# Altium project science_board_proj_rev_1.PrjPcb
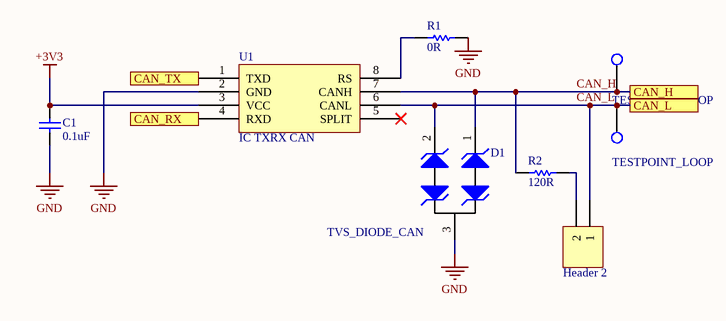
[diagram p0: can.SchDoc]
6 sheets, 127 parts. Net scope: flat (ports and power ports of the same name join across sheets).
Board file: science_board_pcb.PcbDoc
Sheets:
  can.SchDoc
  connectors.SchDoc
  mcu.SchDoc
  ph.SchDoc
  power.SchDoc
  support.SchDoc

## Sheet can.SchDoc: Science Board CAN
size A4

### Parts
1  Header 2  [HDR1X2]
C1  value 0.1uF  [CAPC0603(1608)55_N]  (hidden comment: CAP_0.1uF_16V_0603)
CANH1  TESTPOINT_LOOP  [TESTPOINT_LOOP]
CANL1  TESTPOINT_LOOP  [TESTPOINT_LOOP]
D1  TVS_DIODE_CAN  [TVS_DIODE_CAN]
R1  value 0R  [RESC0603(1608)_N]  (hidden comment: RES_0R_0603)
R2  value 120R  [RESC0603(1608)_N]  (hidden comment: RES_120R_0603)
U1  IC TXRX CAN  [LTC2875]

### Ports
CAN_H, CAN_L, CAN_RX, CAN_TX

### Nets
+3V3: C1.2 U1.3(VCC)
GND: C1.1 D1.3 R1.2 U1.2(GND)
CAN_H: CANH1.1(=value) D1.1 R2.1 U1.7(CANH) ; port CAN_H
CAN_L: 1.1 CANL1.1(=value) D1.2 U1.6(CANL) ; port CAN_L
Net1_2: 1.2 R2.2
NetR1_1: R1.1 U1.8(RS)
NetU1_1: U1.1(TXD) ; port CAN_TX
NetU1_4: U1.4(RXD) ; port CAN_RX

Not connected (* = marked no-connect by the designer): U1 5(SPLIT)*

### Library data of the parts
1 = Header 2: Header, 2-Pin; LatestRevisionDate: 17-Jul-2002; LatestRevisionNote: Re-released for DXP Platform.; Publisher: Altium Limited
C1 = CAP_0.1uF_16V_0603: CAP CER 0.1UF 16V X7R 0603; Part Number: CC0603KRX7R7BB104; Manufacturer: Yageo; Dimensions: 0.063" L x 0.031" W (1.60mm x 0.80mm); Package: 0603 (1608 Metric); Temperature Coefficient: X7R; Voltage Rating: 16V
D1 = TVS_DIODE_CAN: TVS DIODE 24V 41V SOT323-3; Part Number: PESD2CAN,215; Manufacturer: Nexperia USA Inc.; Package: SC-70, SOT-323; ComponentLink1Description: Datasheet; ComponentLink1URL: https://assets.nexperia.com/documents/data-sheet/PESD1CAN-U.pdf
R1 = RES_0R_0603: RES SMD 0 OHM JUMPER 1/10W 0603; Manufacturer: Yageo; Part Number (MPN): RC0603JR-070RL; Package: 0603 (1608 Metric); Dimensions: 0.063" L x 0.031" W (1.60mm x 0.80mm)
R2 = RES_120R_0603: RES SMD 120 OHM 5% 1/10W 0603; Manufacturer: Yageo; Part Number (MPN): RC0603JR-07120RL; Package: 0603 (1608 Metric); Dimensions: 0.063" L x 0.031" W (1.60mm x 0.80mm); Tolerance: 5%
U1 = LTC2875: IC TXRX CAN 4MBPS 8SO; Manufacturer: Linear Technologies; Part Number: LTC2875IS8#PBF; Package: 8-SOIC (0.154", 3.90mm Width); ComponentLink1Description: Datasheet; ComponentLink1URL: https://www.analog.com/media/en/technical-documentation/data-sheets/2875f.pdf

## Sheet connectors.SchDoc: Science Board Connectors
size A4; DrawnBy: Adrianna Ascalon
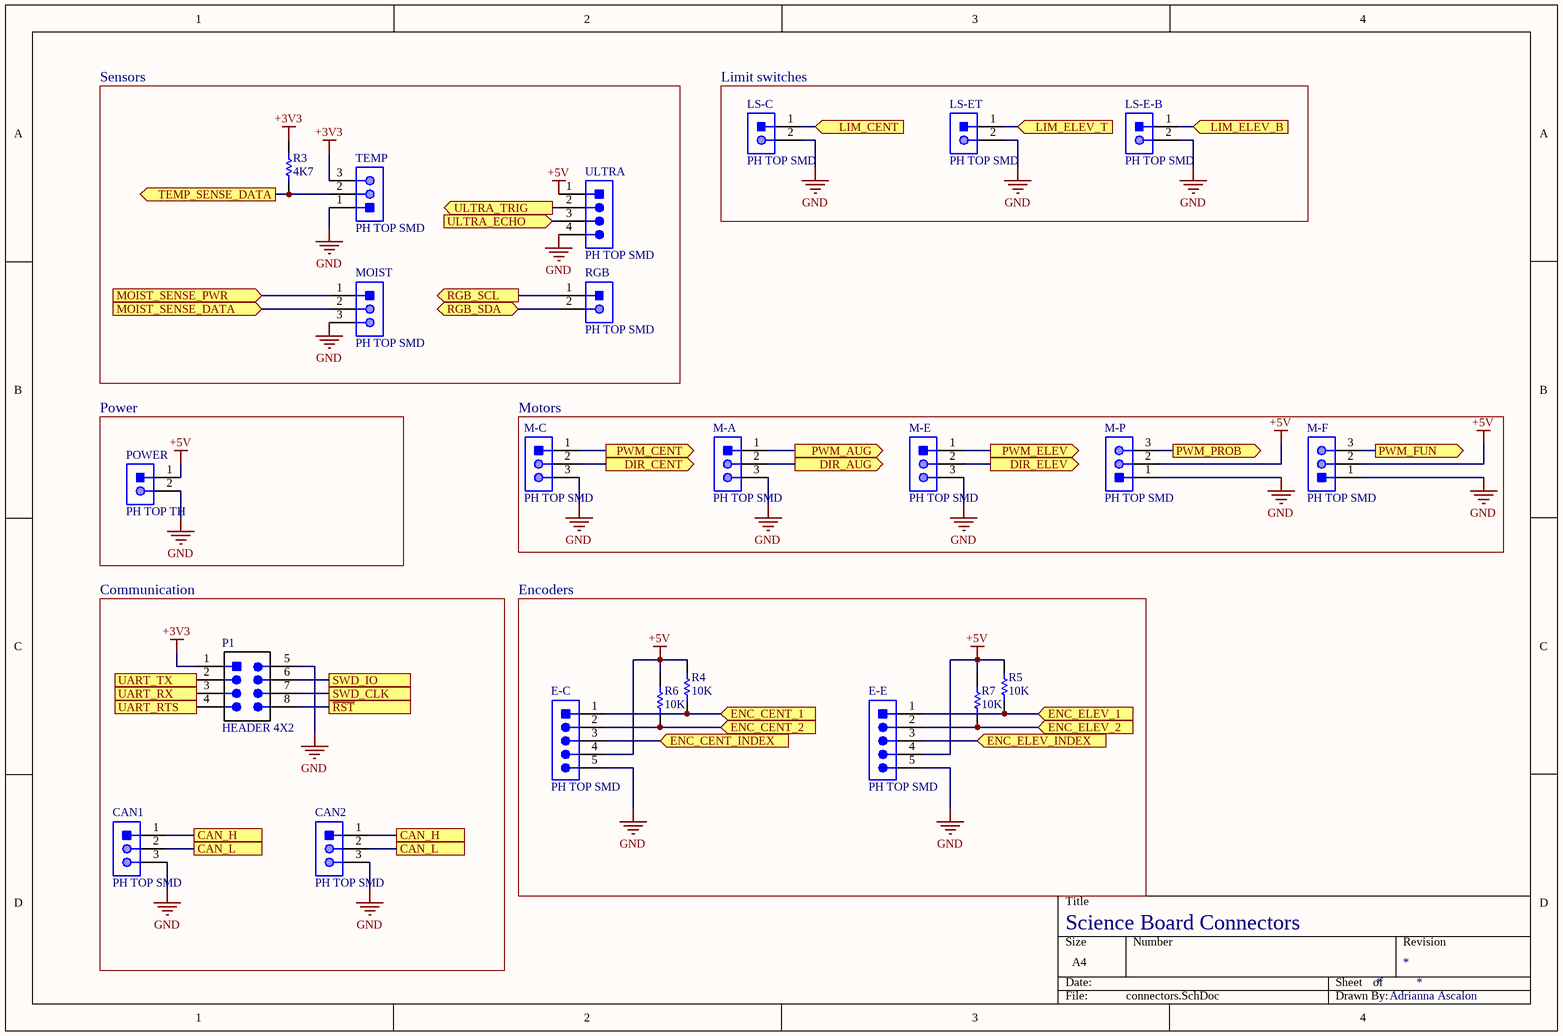
[diagram p1: connectors.SchDoc]

### Parts
CAN1  PH TOP SMD  [JST-B3B-SM4-TB]
CAN2  PH TOP SMD  [JST-B3B-SM4-TB]
E-C  PH TOP SMD  [JST-B5B-SM4-TB]
E-E  PH TOP SMD  [JST-B5B-SM4-TB]
LS-C  PH TOP SMD  [JST-B2B-SM4-TB]
LS-E-B  PH TOP SMD  [JST-B2B-SM4-TB]
LS-ET  PH TOP SMD  [JST-B2B-SM4-TB]
M-A  PH TOP SMD  [JST-B3B-SM4-TB]
M-C  PH TOP SMD  [JST-B3B-SM4-TB]
M-E  PH TOP SMD  [JST-B3B-SM4-TB]
M-F  PH TOP SMD  [JST-B3B-SM4-TB]
M-P  PH TOP SMD  [JST-B3B-SM4-TB]
MOIST  PH TOP SMD  [JST-B3B-SM4-TB]
P1  HEADER 4X2  [HEADER_2X4]
POWER  PH TOP TH  [JST-B2B-PHSK]
R3  value 4K7  [RESC0603(1608)_N]  (hidden comment: RES_4K7_0603)
R4  value 10K  [RESC0603(1608)_N]  (hidden comment: RES_10K_0603)
R5  value 10K  [RESC0603(1608)_N]  (hidden comment: RES_10K_0603)
R6  value 10K  [RESC0603(1608)_N]  (hidden comment: RES_10K_0603)
R7  value 10K  [RESC0603(1608)_N]  (hidden comment: RES_10K_0603)
RGB  PH TOP SMD  [JST-B2B-SM4-TB]
TEMP  PH TOP SMD  [JST-B3B-SM4-TB]
ULTRA  PH TOP SMD  [JST-B4B-SM4-TB]

### Blocks framed on the sheet
Sensors: MOIST R3 RGB TEMP ULTRA
Limit switches: LS-C LS-E-B LS-ET
Power: POWER
Motors: M-A M-C M-E M-F M-P
Communication: CAN1 CAN2 P1
Encoders: E-C E-E R4-R7

### Ports
CAN_H, CAN_L, DIR_AUG (out), DIR_CENT (out), DIR_ELEV (out), ENC_CENT_1 (in), ENC_CENT_2 (in), ENC_CENT_INDEX (in), ENC_ELEV_1 (in), ENC_ELEV_2 (in), ENC_ELEV_INDEX (in), LIM_CENT (in), LIM_ELEV_B (in), LIM_ELEV_T (in), MOIST_SENSE_DATA (in), MOIST_SENSE_PWR (in), PWM_AUG (out), PWM_CENT (out), PWM_ELEV (out), PWM_FUN (out), PWM_PROB (out), RGB_SCL (out), RGB_SDA (bidir), SWD_CLK, SWD_IO, TEMP_SENSE_DATA (out), UART_RTS, UART_RX (in), UART_TX (out), ULTRA_ECHO (in), ULTRA_TRIG (out), ~{RST}

### Nets
+3V3: P1.1(VCC) R3.2 TEMP.3
+5V: E-C.4 E-E.4 M-F.2 M-P.2 POWER.1 R4.2 R5.2 R6.2 R7.2 ULTRA.1
GND: CAN1.3 CAN2.3 E-C.5 E-E.5 LS-C.2 LS-E-B.2 LS-ET.2 M-A.3 M-C.3 M-E.3 M-F.1 M-P.1 MOIST.3 P1.5(GND) POWER.2 TEMP.1 ULTRA.4
CAN_H: CAN1.1 CAN2.1 ; port CAN_H
CAN_L: CAN1.2 CAN2.2 ; port CAN_L
~{RST}: P1.8 ; port ~{RST}
NetE-C_1: E-C.1 R4.1 ; port ENC_CENT_1
NetE-C_2: E-C.2 R6.1 ; port ENC_CENT_2
NetE-C_3: E-C.3 ; port ENC_CENT_INDEX
NetE-E_1: E-E.1 R5.1 ; port ENC_ELEV_1
NetE-E_2: E-E.2 R7.1 ; port ENC_ELEV_2
NetE-E_3: E-E.3 ; port ENC_ELEV_INDEX
NetLS-C_1: LS-C.1 ; port LIM_CENT
NetLS-E-B_1: LS-E-B.1 ; port LIM_ELEV_B
NetLS-ET_1: LS-ET.1 ; port LIM_ELEV_T
NetM-A_1: M-A.1 ; port PWM_AUG
NetM-A_2: M-A.2 ; port DIR_AUG
NetM-C_1: M-C.1 ; port PWM_CENT
NetM-C_2: M-C.2 ; port DIR_CENT
NetM-E_1: M-E.1 ; port PWM_ELEV
NetM-E_2: M-E.2 ; port DIR_ELEV
NetM-F_3: M-F.3 ; port PWM_FUN
NetM-P_3: M-P.3 ; port PWM_PROB
NetMOIST_1: MOIST.1 ; port MOIST_SENSE_PWR
NetMOIST_2: MOIST.2 ; port MOIST_SENSE_DATA
NetP1_2: P1.2 ; port UART_TX
NetP1_3: P1.3 ; port UART_RX
NetP1_4: P1.4 ; port UART_RTS
NetP1_6: P1.6 ; port SWD_IO
NetP1_7: P1.7 ; port SWD_CLK
NetR3_1: R3.1 TEMP.2 ; port TEMP_SENSE_DATA
NetR17_1: RGB.1 ; port RGB_SCL
NetR18_1: RGB.2 ; port RGB_SDA
NetU2_29: ULTRA.2 ; port ULTRA_TRIG
NetU2_30: ULTRA.3 ; port ULTRA_ECHO

### Library data of the parts
CAN1 CAN2 M-A M-C M-E M-F M-P MOIST TEMP = CON_3M_PH_TOP_SMT: CONN HEADER PH TOP 3POS 2MM SMD; Manufacturer: JST; Part Number: B3B-PH-SM4-TB; ComponentLink1Description: Datasheet; ComponentLink1URL: http://www.jst-mfg.com/product/pdf/eng/ePH.pdf
E-C E-E = CON_5M_PH_TOP_SMT: CONN HEADER PH TOP 5POS 2MM SMD; Manufacturer: JST; Part Number: B5B-PH-SM4-TB; ComponentLink1Description: Datasheet; ComponentLink1URL: http://www.jst-mfg.com/product/pdf/eng/ePH.pdf
LS-C LS-E-B LS-ET RGB = CON_2M_PH_TOP_SMT: CONN HEADER PH TOP 2POS 2MM SMD; Manufacturer: JST; Part Number: B2B-PH-SM4-TB; ComponentLink1Description: Datasheet; ComponentLink1URL: http://www.jst-mfg.com/product/pdf/eng/ePH.pdf
P1 = HEADER 4X2: Header, 4-Pin Dual row; LatestRevisionDate: 17-Jul-2002; LatestRevisionNote: Re-released for DXP Platform.; Publisher: Altium Limited
POWER = CON_2M_PH_TOP_TH: CONN HEADER PH TOP 2POS 2MM; Manufacturer: JST; Part Number: B2B-PH-K-S; ComponentLink1Description: Datasheet; ComponentLink1URL: http://www.jst-mfg.com/product/pdf/eng/ePH.pdf
R3 = RES_4K7_0603: RES SMD 4.7K OHM 5% 1/10W 0603; Manufacturer: Yageo; Part Number (MPN): RC0603JR-074K7L; Package: 0603 (1608 Metric); Dimensions: 0.063" L x 0.031" W (1.60mm x 0.80mm); Tolerance: 5%
R4-R7 = RES_10K_0603: RES SMD 10K OHM 5% 1/10W 0603; Manufacturer: Yageo; Part Number (MPN): RC0603JR-0710KL; Package: 0603 (1608 Metric); Dimensions: 0.063" L x 0.031" W (1.60mm x 0.80mm); Tolerance: 5%
ULTRA = CON_4M_PH_TOP_SMT: CONN HEADER PH TOP 4POS 2MM SMD; Manufacturer: JST; Part Number: B4B-PH-SM4-TB; ComponentLink1Description: Datasheet; ComponentLink1URL: http://www.jst-mfg.com/product/pdf/eng/ePH.pdf

## Sheet mcu.SchDoc: Science Board MCU
size A4; DrawnBy: Adrianna Ascalon
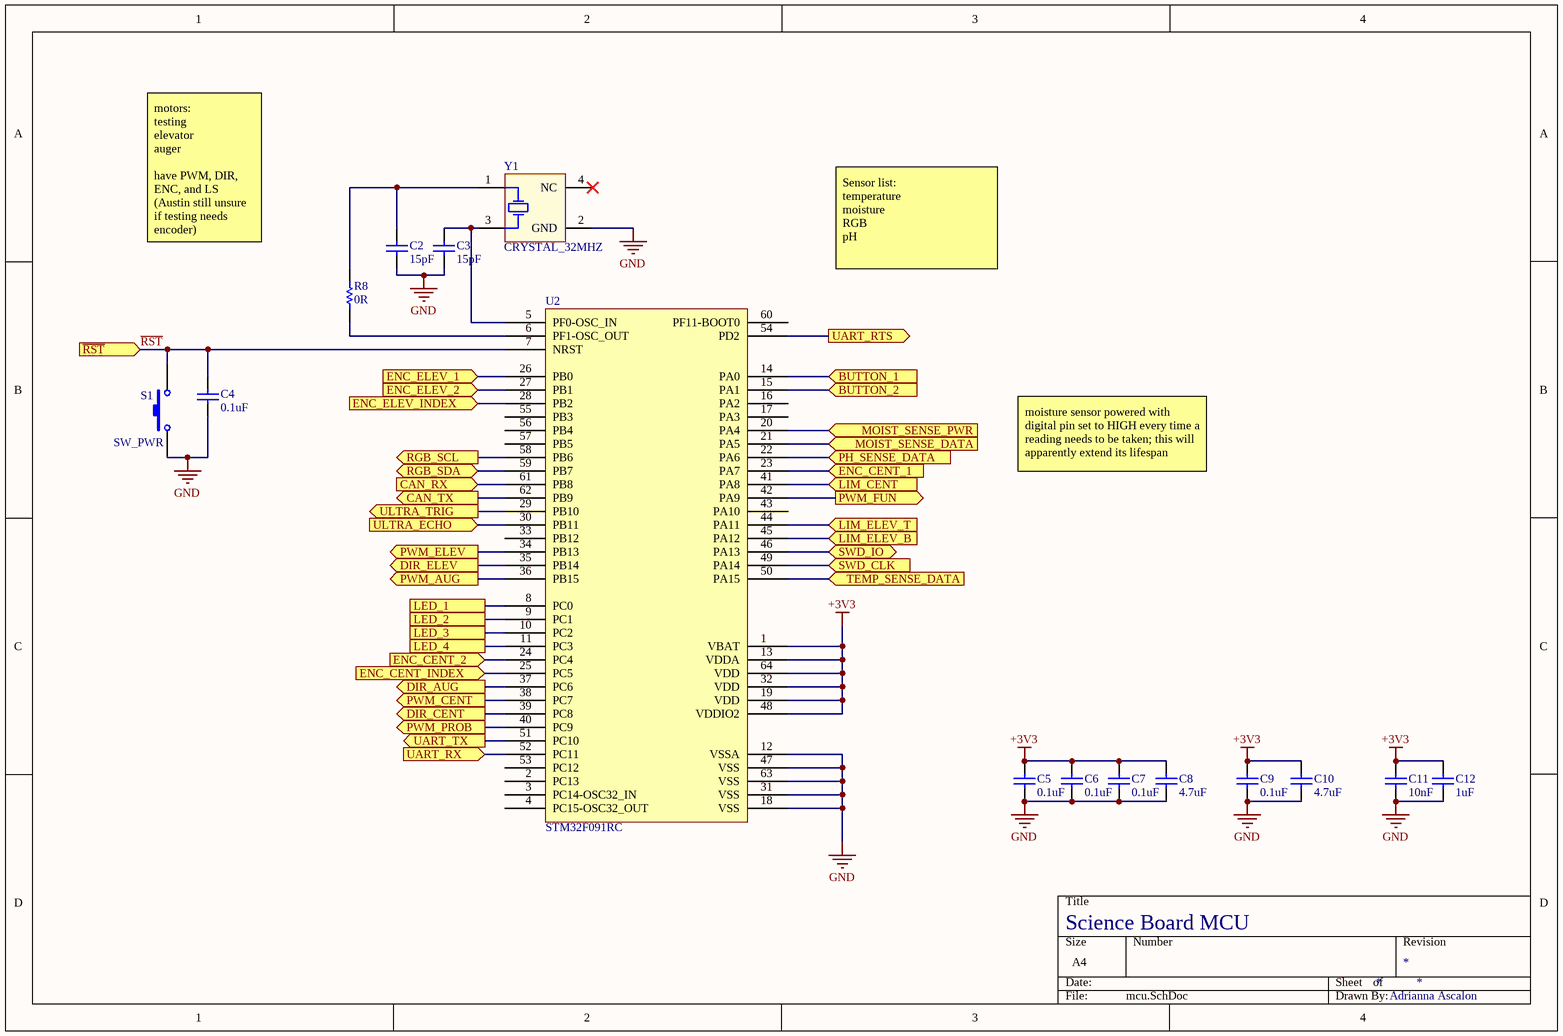
[diagram p2: mcu.SchDoc]

### Parts
C2  value 15pF  [CAPC0603(1608)55_N]  (hidden comment: CAP_15pF_0603)
C3  value 15pF  [CAPC0603(1608)55_N]  (hidden comment: CAP_15pF_0603)
C4  value 0.1uF  [CAPC0603(1608)55_N]  (hidden comment: CAP_0.1uF_16V_0603)
C5  value 0.1uF  [CAPC0603(1608)55_N]  (hidden comment: CAP_0.1uF_16V_0603)
C6  value 0.1uF  [CAPC0603(1608)55_N]  (hidden comment: CAP_0.1uF_16V_0603)
C7  value 0.1uF  [CAPC0603(1608)55_N]  (hidden comment: CAP_0.1uF_16V_0603)
C8  value 4.7uF  [CAPC0603(1608)55_N]  (hidden comment: CAP_4.7uF_0603)
C9  value 0.1uF  [CAPC0603(1608)55_N]  (hidden comment: CAP_0.1uF_16V_0603)
C10  value 4.7uF  [CAPC0603(1608)55_N]  (hidden comment: CAP_4.7uF_0603)
C11  value 10nF  [CAPC0603(1608)55_N]  (hidden comment: CAP_10nF_0603)
C12  value 1uF  [CAPC0603(1608)55_N]  (hidden comment: CAP_1uF_16V_0603)
R8  value 0R  [RESC0603(1608)_N]  (hidden comment: RES_0R_0603)
S1  SW_PWR  [PTS830GM140]
U2  STM32F091RC  [STM_LQFP64_N]
Y1  CRYSTAL_32MHZ  [AVX-CX2520DB32000D0GEJZ1-4_V]

### Ports
BUTTON_1 (in), BUTTON_2 (in), CAN_RX (in), CAN_TX (out), DIR_AUG (out), DIR_CENT (out), DIR_ELEV (out), ENC_CENT_1 (in), ENC_CENT_2 (in), ENC_CENT_INDEX (in), ENC_ELEV_1 (in), ENC_ELEV_2 (in), ENC_ELEV_INDEX (in), LED_1, LED_2, LED_3, LED_4, LIM_CENT (in), LIM_ELEV_B (in), LIM_ELEV_T (in), MOIST_SENSE_DATA (in), MOIST_SENSE_PWR (in), PH_SENSE_DATA (in), PWM_AUG (out), PWM_CENT (out), PWM_ELEV (out), PWM_FUN (out), PWM_PROB (out), RGB_SCL (out), RGB_SDA (bidir), SWD_CLK (in), SWD_IO (bidir), TEMP_SENSE_DATA (in), UART_RTS (out), UART_RX (in), UART_TX (out), ULTRA_ECHO (in), ULTRA_TRIG (out), ~{RST} (in)

### Nets
+3V3: C5.1 C6.1 C7.1 C8.2 C9.1 C10.2 C11.2 C12.2 U2.1(VBAT) U2.13(VDDA) U2.19(VDD) U2.32(VDD) U2.48(VDDIO2) U2.64(VDD)
GND: C2.1 C3.1 C4.1 C5.2 C6.2 C7.2 C8.1 C9.2 C10.1 C11.1 C12.1 S1.1 U2.12(VSSA) U2.18(VSS) U2.31(VSS) U2.47(VSS) U2.63(VSS) Y1.2(GND)
~{RST}: C4.2 S1.2 U2.7(NRST) ; port ~{RST}
NetC2_2: C2.2 R8.2 Y1.1(HOT)
NetC3_2: C3.2 U2.5(PF0-OSC_IN) Y1.3(HOT)
NetE-C_1: U2.23(PA7) ; port ENC_CENT_1
NetE-C_2: U2.24(PC4) ; port ENC_CENT_2
NetE-C_3: U2.25(PC5) ; port ENC_CENT_INDEX
NetE-E_1: U2.26(PB0) ; port ENC_ELEV_1
NetE-E_2: U2.27(PB1) ; port ENC_ELEV_2
NetE-E_3: U2.28(PB2) ; port ENC_ELEV_INDEX
NetLS-C_1: U2.41(PA8) ; port LIM_CENT
NetLS-E-B_1: U2.45(PA12) ; port LIM_ELEV_B
NetLS-ET_1: U2.44(PA11) ; port LIM_ELEV_T
NetM-A_1: U2.36(PB15) ; port PWM_AUG
NetM-A_2: U2.37(PC6) ; port DIR_AUG
NetM-C_1: U2.38(PC7) ; port PWM_CENT
NetM-C_2: U2.39(PC8) ; port DIR_CENT
NetM-E_1: U2.34(PB13) ; port PWM_ELEV
NetM-E_2: U2.35(PB14) ; port DIR_ELEV
NetM-F_3: U2.42(PA9) ; port PWM_FUN
NetM-P_3: U2.40(PC9) ; port PWM_PROB
NetMOIST_1: U2.20(PA4) ; port MOIST_SENSE_PWR
NetMOIST_2: U2.21(PA5) ; port MOIST_SENSE_DATA
NetP1_2: U2.51(PC10) ; port UART_TX
NetP1_3: U2.52(PC11) ; port UART_RX
NetP1_4: U2.54(PD2) ; port UART_RTS
NetP1_6: U2.46(PA13) ; port SWD_IO
NetP1_7: U2.49(PA14) ; port SWD_CLK
NetPH_1: U2.22(PA6) ; port PH_SENSE_DATA
NetR3_1: U2.50(PA15) ; port TEMP_SENSE_DATA
NetR8_1: R8.1 U2.6(PF1-OSC_OUT)
NetR17_1: U2.58(PB6) ; port RGB_SCL
NetR18_1: U2.59(PB7) ; port RGB_SDA
NetR27_1: U2.8(PC0) ; port LED_1
NetR28_1: U2.9(PC1) ; port LED_2
NetR29_1: U2.14(PA0) ; port BUTTON_1
NetR30_1: U2.10(PC2) ; port LED_3
NetR31_2: U2.15(PA1) ; port BUTTON_2
NetR33_1: U2.11(PC3) ; port LED_4
NetU1_1: U2.62(PB9) ; port CAN_TX
NetU1_4: U2.61(PB8) ; port CAN_RX
NetU2_29: U2.29(PB10) ; port ULTRA_TRIG
NetU2_30: U2.30(PB11) ; port ULTRA_ECHO

Not connected (* = marked no-connect by the designer): U2 2(PC13) 3(PC14-OSC32_IN) 4(PC15-OSC32_OUT) 16(PA2) 17(PA3) 33(PB12) 43(PA10) 53(PC12) 55(PB3) 56(PB4) 57(PB5) 60(PF11-BOOT0); Y1 4(NC)*

### Notes on the sheet
- motors:
  testing
  elevator
  auger
  have PWM, DIR, ENC, and LS
  (Austin still unsure if testing needs encoder)
  Auger doesn't need ENC or LS
- Sensor list:
  temperature
  moisture
  RGB
  pH
- moisture sensor powered with digital pin set to HIGH every time a reading needs to be taken; this will apparently extend its lifespan

### Library data of the parts
C2 C3 = CAP_15pF_0603: CAP CER 15PF 250V NPO 0603; Part Number: AC0603JRNPOYBN150; Manufacturer: Yageo; Temperature Coefficient: NP0; Dimensions: 0.063" L x 0.031" W (1.60mm x 0.80mm); Package: 0603 (1608 Metric); Voltage Rating: 250v
C4-C7 C9 = CAP_0.1uF_16V_0603: as C1 on sheet can; Dimensions: 0.063" L x 0.031" W (1.60mm x 0.80mm); Package: 0603 (1608 Metric); Temperature Coefficient: X7R; Voltage Rating: 16V
C8 C10 = CAP_4.7uF_0603: CAP CER 4.7UF 6.3V X5R 0603; Part Number: CC0603KRX5R5BB475; Manufacturer: Yageo; Dimensions: 0.063" L x 0.031" W (1.60mm x 0.80mm); Package: 0603 (1608 Metric); Temperature Coefficient: X5R; Voltage Rating: 6.3V
C11 = CAP_10nF_0603: CAP CER 10000PF 16V X7R 0603; Part Number: CC0603KRX7R7BB103; Manufacturer: Yageo; Dimensions: 0.063" L x 0.031" W (1.60mm x 0.80mm); Package: 0603 (1608 Metric); Temperature Coefficient: X7R; Voltage Rating: 16V
C12 = CAP_1uF_16V_0603: CAP CER 1UF 16V Y5V 0603; Part Number: CC0603ZRY5V7BB105; Manufacturer: Yageo; Dimensions: 0.063" L x 0.031" W (1.60mm x 0.80mm); Package: 0603 (1608 Metric); Temperature Coefficient: Y5V; Voltage Rating: 16V
R8 = RES_0R_0603: as R1 on sheet can; Package: 0603 (1608 Metric); Dimensions: 0.063" L x 0.031" W (1.60mm x 0.80mm)
S1 = SW_PWR: Power Switch (Red); pin to pad: 2>4; Part Number: PTS830GM140 SMTR LFS; ComponentLink1Description: Datasheet; ComponentLink1URL: https://www.ckswitches.com/media/1478/pts830.pdf
U2 = STM32F091RC: Manufacturer: STMicroelectronics; Part Number: STM32F091RC; Package: 64-LQFP; ComponentLink1Description: Datasheet; ComponentLink1URL: https://www.st.com/content/ccc/resource/technical/document/datasheet/95/3c/2e/5b/21/09/45/a6/DM00115237.pdf/files/DM00115237.pdf/jcr:content/translations/en.DM00115237.pdf#%5B%7B%22num%22%3A96%2C%22gen%22%3A0%7D%2C%7B%22name%22%3A%22XYZ%22%7D%2C67%2C755%2Cnull%5D
Y1 = CRYSTAL_32MHZ: CRYSTAL 32MHZ 8PF SMD; Part Number: CX2520DB32000D0GPSC1; Manufacturer: Kyocera International Inc. Electronic Components; Package: 4-SMD, No Lead; Dimensions: 0.098" L x 0.079" W (2.50mm x 2.00mm)

## Sheet ph.SchDoc: Science Board pH Sensing
size A4
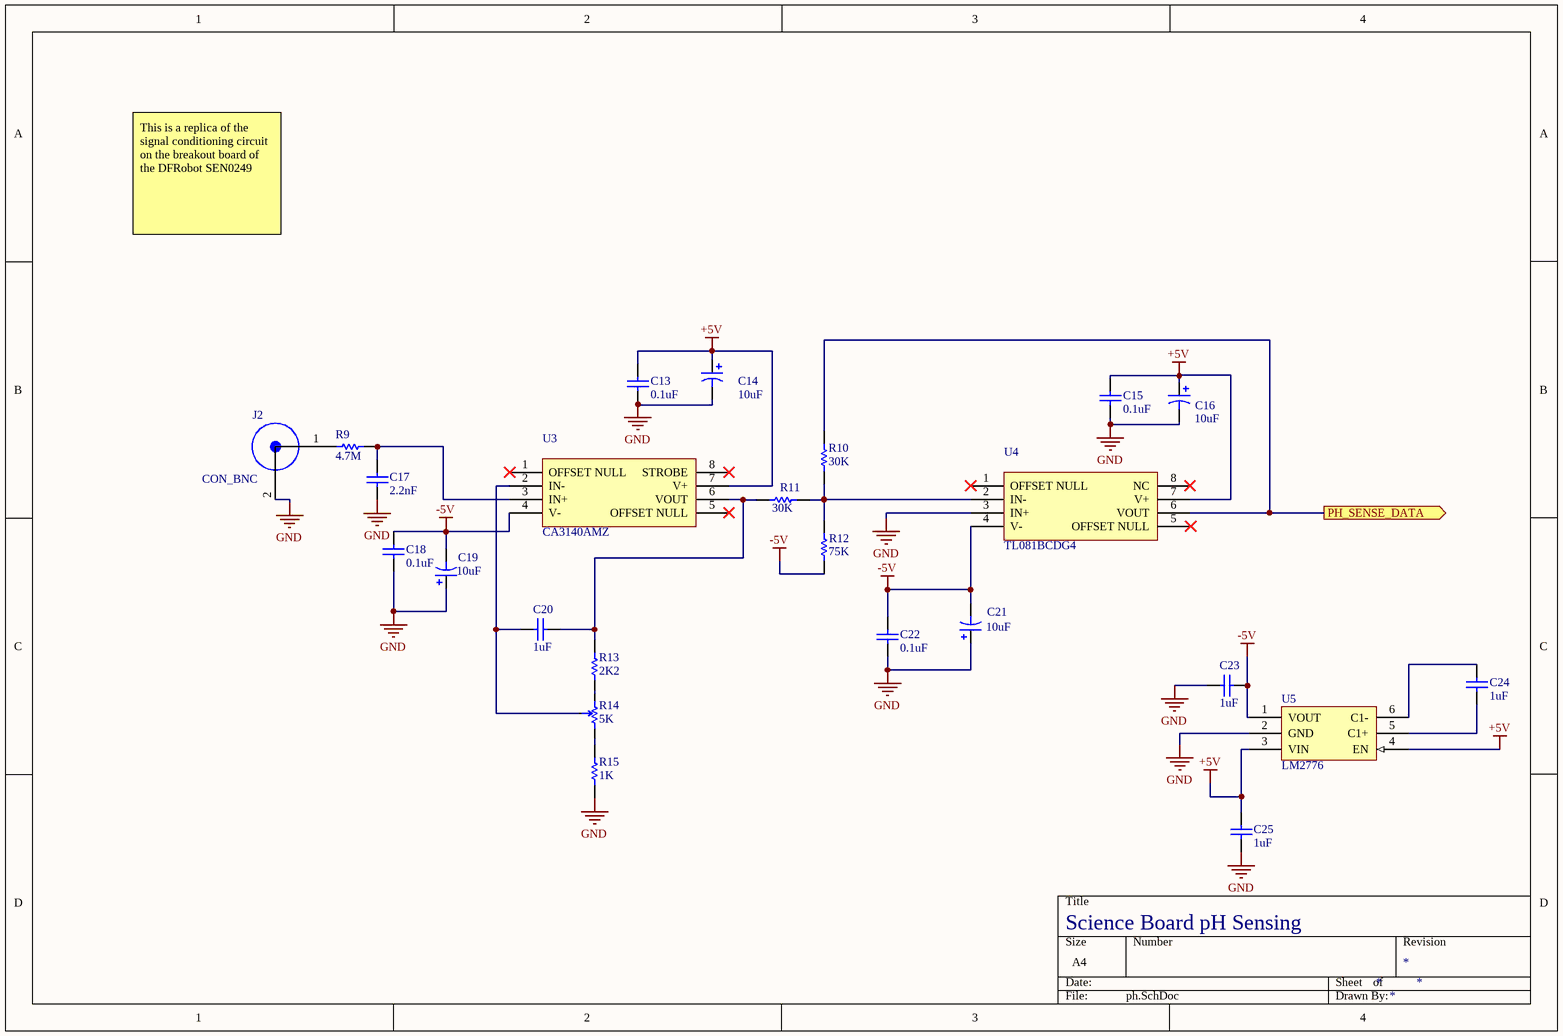
[diagram p3: ph.SchDoc]

### Parts
C13  value 0.1uF  [CAPC0603(1608)55_N]  (hidden comment: CAP_0.1uF_50V_0603)
C14  value 10uF  [AVX-CAPC3528_V]  (hidden comment: CAP_10uF_0603_POL)
C15  value 0.1uF  [CAPC0603(1608)55_N]  (hidden comment: CAP_0.1uF_50V_0603)
C16  value 10uF  [AVX-CAPC3528_V]  (hidden comment: CAP_10uF_0603_POL)
C17  value 2.2nF  [CAPC0603(1608)55_N]  (hidden comment: CAP_2.2nF_0603)
C18  value 0.1uF  [CAPC0603(1608)55_N]  (hidden comment: CAP_0.1uF_50V_0603)
C19  value 10uF  [AVX-CAPC3528_V]  (hidden comment: CAP_10uF_0603_POL)
C20  value 1uF  [CAPC0603(1608)55_N]  (hidden comment: CAP_1uF_16V_0603)
C21  value 10uF  [AVX-CAPC3528_V]  (hidden comment: CAP_10uF_0603_POL)
C22  value 0.1uF  [CAPC0603(1608)55_N]  (hidden comment: CAP_0.1uF_50V_0603)
C23  value 1uF  [CAPC0603(1608)55_N]  (hidden comment: CAP_1uF_16V_0603)
C24  value 1uF  [CAPC0603(1608)55_N]  (hidden comment: CAP_1uF_16V_0603)
C25  value 1uF  [CAPC0603(1608)55_N]  (hidden comment: CAP_1uF_16V_0603)
J2  CON_BNC  [1-1337543-0]
R9  value 4.7M  [RESC0603(1608)_N]  (hidden comment: RES_4M7_0603)
R10  value 30K  [RESC0603(1608)_N]  (hidden comment: RES_30K_0603)
R11  value 30K  [RESC0603(1608)_N]  (hidden comment: RES_30K_0603)
R12  value 75K  [RESC0603(1608)_N]  (hidden comment: RES_75K_0603)
R13  value 2K2  [RESC0603(1608)_N]  (hidden comment: RES_2K2_0603)
R14  value 5K  [3362P-1-502LF]  (hidden comment: POT_5K)
R15  value 1K  [RESC0603(1608)_N]  (hidden comment: RES_1K_0603)
U3  CA3140AMZ  [CA3140AMZ]
U4  TL081BCDG4  [TL081BCDG4]
U5  LM2776  [SOT23-6]

### Ports
PH_SENSE_DATA (out)

### Nets
+5V: C13.2 C14.1 C15.2 C16.1 C25.2 U3.7(V+) U4.7(V+) U5.3(VIN) U5.4(EN)
-5V: C18.2 C19.2 C21.2 C22.2 C23.1 R12.1 U3.4(V-) U4.4(V-) U5.1(VOUT)
GND: C13.1 C14.2 C15.1 C16.2 C17.1 C18.1 C19.1 C21.1 C22.1 C23.2 C25.1 J2.2 R15.1 U4.3(IN+) U5.2(GND)
NetC17_2: C17.2 R9.2 U3.3(IN+)
NetC20_1: C20.1 R14.3 U3.2(IN-)
NetC20_2: C20.2 R11.1 R13.2 U3.6(VOUT)
NetC24_1: C24.1 U5.5(C1+)
NetC24_2: C24.2 U5.6(C1-)
NetJ2_1: J2.1 R9.1
NetPH_1: R10.2 U4.6(VOUT) ; port PH_SENSE_DATA
NetR10_1: R10.1 R11.2 R12.2 U4.2(IN-)
NetR13_1: R13.1 R14.1
NetR14_2: R14.2 R15.2

Not connected (* = marked no-connect by the designer): U3 1(OFFSET_NULL)* 5(OFFSET_NULL)* 8(STROBE)*; U4 1(OFFSET_NULL)* 5(OFFSET_NULL)* 8(NC)*

### Notes on the sheet
- This is a replica of the signal conditioning circuit on the breakout board of the DFRobot SEN0249

### Library data of the parts
C13 C15 C18 C22 = CAP_0.1uF_50V_0603: CAP CER 0.1UF 50V X7R 0603; Part Number: GCM188R71H104KA57D; Manufacturer: Yageo; Dimensions: 0.063" L x 0.031" W (1.60mm x 0.80mm); Package: 0603 (1608 Metric); Temperature Coefficient: X7R; Voltage Rating: 50V
C14 C16 C19 C21 = CAP_10uF_0603_POL: Capacitor, Tantalum, 10uF 10% 20V MCCT-B (3528); Part Number: CC0603MRX5R6BB106; Manufacturer: Yageo; Temperature Coefficient: X5R; Voltage Rating: 10V; Dimensions: 0.063" L x 0.031" W (1.60mm x 0.80mm); Package: 0603 (1608 Metric)
C17 = CAP_2.2nF_0603: CAP CER 2.2NF 25V X7R 0603; Part Number: CC0603KRX7R8BB222; Manufacturer: Yageo; Dimensions: 0.063" L x 0.031" W (1.60mm x 0.80mm); Package: 0603 (1608 Metric); Temperature Coefficient: X7R; Voltage Rating: 25V
C20 C23-C25 = CAP_1uF_16V_0603: as C12 on sheet mcu; Dimensions: 0.063" L x 0.031" W (1.60mm x 0.80mm); Package: 0603 (1608 Metric); Temperature Coefficient: Y5V; Voltage Rating: 16V
J2 = CON_BNC: Manufacturer: TE Connectivity; Part Number (MPN): 1-1337543-0
R9 = RES_4M7_0603: RES SMD 4.7M OHM 1% 1/10W 0603; Part Number (MPN): RC0603FR-074M7L; Manufacturer: Yageo; Package: 0603 (1608 Metric); Dimensions: 0.063" L x 0.031" W (1.60mm x 0.80mm); Tolerance: 1%
R10 R11 = RES_30K_0603: RES SMD 30K OHM 0.5% 1/10W 0603; Manufacturer: Yageo; Part Number (MPN): RT0603DRD0730KL; Package: 0603 (1608 Metric); Dimensions: 0.063" L x 0.031" W (1.60mm x 0.80mm); Tolerance: 0.5%; Digikey Part Number: 311-30KDCT-ND
R12 = RES_75K_0603: RES SMD 75K OHM 0.5% 1/10W 0603; Manufacturer: Yageo; Part Number (MPN): RT0603DRD0775KL; Package: 0603 (1608 Metric); Dimensions: 0.063" L x 0.031" W (1.60mm x 0.80mm); Tolerance: 0.5%; Digikey Part Number: 311-75KDCT-ND
R13 = RES_2K2_0603: RES SMD 2.2K OHM 1% 1/10W 0603; Manufacturer: Yageo; Part Number (MPN): RC0603FR-072K2L; Dimensions: 0.063" L x 0.031" W (1.60mm x 0.80mm); Package: 0603 (1608 Metric); Tolerance: 1%
R14 = POT_5K: TRIMMER 5K OHM 0.5W PC PIN TOP; Manufacturer: Bourns Inc.; Tolerance: 10%; Part Number (MPN): 3362P-1-502LF; Dimensions: 0.275" x 0.260" Face x 0.185" H (6.99mm x 6.60mm x 4.70mm)
R15 = RES_1K_0603: RES SMD 1K OHM 5% 1/10W 0603; Manufacturer: Yageo; Part Number (MPN): RC0603JR-071KL; Dimensions: 0.063" L x 0.031" W (1.60mm x 0.80mm); Tolerance: 5%; Package: 0603 (1608 Metric)
U3 = CA3140AMZ: 4.5MHz, BiMOS Operational Amplifier with MOSFET Input/Bipolar Output
U4 = TL081BCDG4: IC OPAMP JFET 3MHZ 8SOIC; Parameter 1: *
U5 = LM2776: LM2776 Switched Capacitor Inverter

## Sheet power.SchDoc: Power
size A4; DrawnBy: Adrianna Ascalon
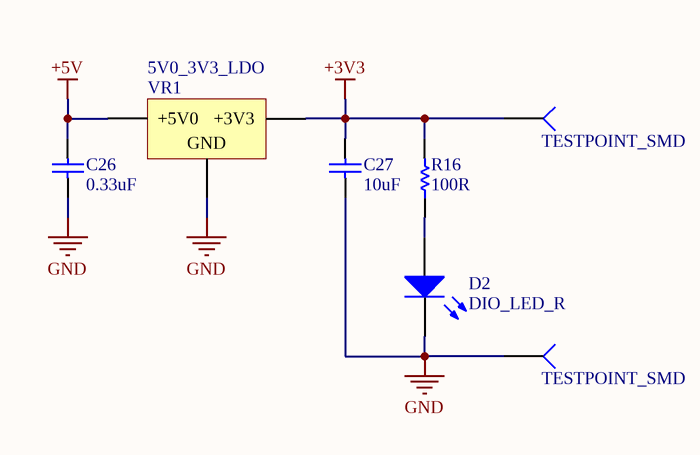
[diagram p4: power.SchDoc]

### Parts
3V3  TESTPOINT_SMD  [TESTPOINT]
C26  value 0.33uF  [CAPC0603(1608)55_N]  (hidden comment: CAP_0.33uF_16V_0603)
C27  value 10uF  [CAPC0603(1608)55_N]  (hidden comment: CAP_10uF_0603)
D2  DIO_LED_R  [LED_0805]
GND  TESTPOINT_SMD  [TESTPOINT]
R16  value 100R  [RESC0603(1608)_N]  (hidden comment: RES_100R_0603)
VR1  5V0_3V3_LDO  [VOLTAGE_REGULATOR]

### Nets
+3V3: 3V3.1(=value) C27.2 R16.2 VR1.2(+3V3)
+5V: C26.2 VR1.3(+5V0)
GND: C26.1 C27.1 D2.2(K) GND.1(=value) VR1.1(GND)
NetD2_1: D2.1(A) R16.1

### Library data of the parts
C26 = CAP_0.33uF_16V_0603: CAP CER 0.33UF 16V X7R 0603; Part Number: GRM188R71C334KA01D; Manufacturer: Murata Electronics North America; Dimensions: 0.063" L x 0.031" W (1.60mm x 0.80mm); Package: 0603 (1608 Metric); Temperature Coefficient: X7R; Voltage Rating: 16V
C27 = CAP_10uF_0603: CAP CER 10UF 10V X5R 0603; Part Number: CC0603MRX5R6BB106; Manufacturer: Yageo; Dimensions: 0.063" L x 0.031" W (1.60mm x 0.80mm); Package: 0603 (1608 Metric); Temperature Coefficient: X5R; Voltage Rating: 10V
D2 = DIO_LED_R: LED RED DIFFUSED 0805 SMD; Part Number: LS R976-NR-1; Manufacturer: OSRAM; Forward Voltage Drop: 2V; Package: 0805 (2012 Metric)
R16 = RES_100R_0603: RES SMD 100 OHM 1% 1/10W 0603; Manufacturer: Yageo; Part Number (MPN): RC0603FR-07100RL; Package: 0603 (1608 Metric); Dimensions: 0.063" L x 0.031" W (1.60mm x 0.80mm); Tolerance: 1%
VR1 = 5V0_3V3_LDO: IC REG LINEAR 3.3V 1A DPAK; Part Number: NCP1117DT33T5G; Manufacturer: ON Semiconductor; Current Output: 1A
3V3 GND = TESTPOINT_SMD: Part Number (MPN): *

## Sheet support.SchDoc: Support
size A4; DrawnBy: Adrianna Ascalon
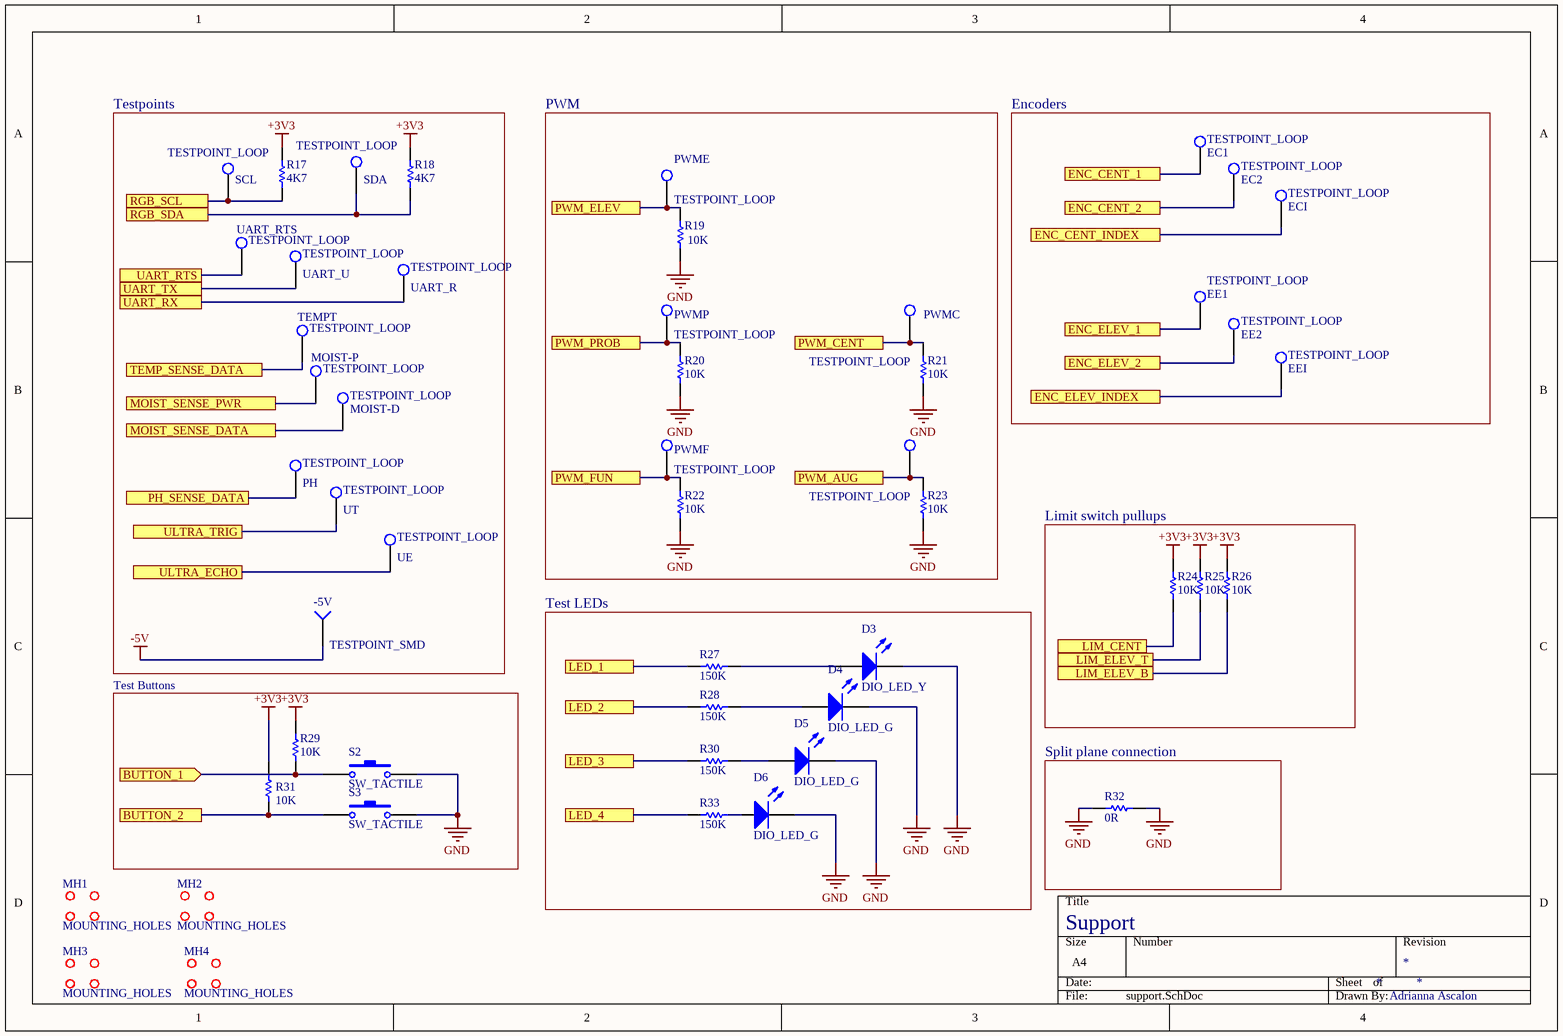
[diagram p5: support.SchDoc]

### Parts
-5V  TESTPOINT_SMD  [TESTPOINT]
D3  DIO_LED_Y  [LED_0805_LINE]
D4  DIO_LED_G  [LED_0805_LINE]
D5  DIO_LED_G  [LED_0805_LINE]
D6  DIO_LED_G  [LED_0805_LINE]
EC1  TESTPOINT_LOOP  [TESTPOINT_LOOP]
EC2  TESTPOINT_LOOP  [TESTPOINT_LOOP]
ECI  TESTPOINT_LOOP  [TESTPOINT_LOOP]
EE1  TESTPOINT_LOOP  [TESTPOINT_LOOP]
EE2  TESTPOINT_LOOP  [TESTPOINT_LOOP]
EEI  TESTPOINT_LOOP  [TESTPOINT_LOOP]
MH1  MOUNTING_HOLES  [MOUNTING_HOLE]
MH2  MOUNTING_HOLES  [MOUNTING_HOLE]
MH3  MOUNTING_HOLES  [MOUNTING_HOLE]
MH4  MOUNTING_HOLES  [MOUNTING_HOLE]
MOIST-D  TESTPOINT_LOOP  [TESTPOINT_LOOP]
MOIST-P  TESTPOINT_LOOP  [TESTPOINT_LOOP]
PH  TESTPOINT_LOOP  [TESTPOINT_LOOP]
PWMA  TESTPOINT_LOOP  [TESTPOINT_LOOP]
PWMC  TESTPOINT_LOOP  [TESTPOINT_LOOP]
PWME  TESTPOINT_LOOP  [TESTPOINT_LOOP]
PWMF  TESTPOINT_LOOP  [TESTPOINT_LOOP]
PWMP  TESTPOINT_LOOP  [TESTPOINT_LOOP]
R17  value 4K7  [RESC0603(1608)_N]  (hidden comment: RES_4K7_0603)
R18  value 4K7  [RESC0603(1608)_N]  (hidden comment: RES_4K7_0603)
R19  value 10K  [RESC0603(1608)_N]  (hidden comment: RES_10K_0603)
R20  value 10K  [RESC0603(1608)_N]  (hidden comment: RES_10K_0603)
R21  value 10K  [RESC0603(1608)_N]  (hidden comment: RES_10K_0603)
R22  value 10K  [RESC0603(1608)_N]  (hidden comment: RES_10K_0603)
R23  value 10K  [RESC0603(1608)_N]  (hidden comment: RES_10K_0603)
R24  value 10K  [RESC0603(1608)_N]  (hidden comment: RES_10K_0603)
R25  value 10K  [RESC0603(1608)_N]  (hidden comment: RES_10K_0603)
R26  value 10K  [RESC0603(1608)_N]  (hidden comment: RES_10K_0603)
R27  value 150K  [RESC0603(1608)_N]  (hidden comment: RES_150K_0603)
R28  value 150K  [RESC0603(1608)_N]  (hidden comment: RES_150K_0603)
R29  value 10K  [RESC0603(1608)_N]  (hidden comment: RES_10K_0603)
R30  value 150K  [RESC0603(1608)_N]  (hidden comment: RES_150K_0603)
R31  value 10K  [RESC0603(1608)_N]  (hidden comment: RES_10K_0603)
R32  value 0R  [RESC0603(1608)_N]  (hidden comment: RES_0R_0603)
R33  value 150K  [RESC0603(1608)_N]  (hidden comment: RES_150K_0603)
S2  SW_TACTILE  [B3U-1100P]
S3  SW_TACTILE  [B3U-1100P]
SCL  TESTPOINT_LOOP  [TESTPOINT_LOOP]
SDA  TESTPOINT_LOOP  [TESTPOINT_LOOP]
TEMPT  TESTPOINT_LOOP  [TESTPOINT_LOOP]
UART_R  TESTPOINT_LOOP  [TESTPOINT_LOOP]
UART_RTS  TESTPOINT_LOOP  [TESTPOINT_LOOP]
UART_U  TESTPOINT_LOOP  [TESTPOINT_LOOP]
UE  TESTPOINT_LOOP  [TESTPOINT_LOOP]
UT  TESTPOINT_LOOP  [TESTPOINT_LOOP]

### Blocks framed on the sheet
Testpoints: -5V MOIST-D MOIST-P PH R17 R18 SCL SDA TEMPT UART_R UART_RTS UART_U UE UT
PWM: PWMA PWMC PWME PWMF PWMP R19-R23
Encoders: EC1 EC2 ECI EE1 EE2 EEI
Limit switch pullups: R24-R26
Test LEDs: D3-D6 R27 R28 R30 R33
Test Buttons: R29 R31 S2 S3
Split plane connection: R32

### Ports
BUTTON_1 (in), BUTTON_2, ENC_CENT_1, ENC_CENT_2, ENC_CENT_INDEX, ENC_ELEV_1, ENC_ELEV_2, ENC_ELEV_INDEX, LED_1, LED_2, LED_3, LED_4, LIM_CENT, LIM_ELEV_B, LIM_ELEV_T, MOIST_SENSE_DATA, MOIST_SENSE_PWR, PH_SENSE_DATA, PWM_AUG, PWM_CENT, PWM_ELEV, PWM_FUN, PWM_PROB, RGB_SCL, RGB_SDA, TEMP_SENSE_DATA, UART_RTS, UART_RX, UART_TX, ULTRA_ECHO, ULTRA_TRIG

### Nets
+3V3: R17.2 R18.2 R24.2 R25.2 R26.2 R29.2 R31.1
-5V: -5V.1(=value)
GND: D3.2(K) D4.2(K) D5.2(K) D6.2(K) R19.1 R20.1 R21.1 R22.1 R23.1 R32.1 R32.2 S2.2 S3.2
NetD3_1: D3.1(A) R27.2
NetD4_1: D4.1(A) R28.2
NetD5_1: D5.1(A) R30.2
NetD6_1: D6.1(A) R33.2
NetE-C_1: EC1.1(=value) ; port ENC_CENT_1
NetE-C_2: EC2.1(=value) ; port ENC_CENT_2
NetE-C_3: ECI.1(=value) ; port ENC_CENT_INDEX
NetE-E_1: EE1.1(=value) ; port ENC_ELEV_1
NetE-E_2: EE2.1(=value) ; port ENC_ELEV_2
NetE-E_3: EEI.1(=value) ; port ENC_ELEV_INDEX
NetLS-C_1: R24.1 ; port LIM_CENT
NetLS-E-B_1: R26.1 ; port LIM_ELEV_B
NetLS-ET_1: R25.1 ; port LIM_ELEV_T
NetM-A_1: PWMA.1(=value) R23.2 ; port PWM_AUG
NetM-C_1: PWMC.1(=value) R21.2 ; port PWM_CENT
NetM-E_1: PWME.1(=value) R19.2 ; port PWM_ELEV
NetM-F_3: PWMF.1(=value) R22.2 ; port PWM_FUN
NetM-P_3: PWMP.1(=value) R20.2 ; port PWM_PROB
NetMOIST_1: MOIST-P.1(=value) ; port MOIST_SENSE_PWR
NetMOIST_2: MOIST-D.1(=value) ; port MOIST_SENSE_DATA
NetP1_2: UART_U.1(=value) ; port UART_TX
NetP1_3: UART_R.1(=value) ; port UART_RX
NetP1_4: UART_RTS.1(=value) ; port UART_RTS
NetPH_1: PH.1(=value) ; port PH_SENSE_DATA
NetR3_1: TEMPT.1(=value) ; port TEMP_SENSE_DATA
NetR17_1: R17.1 SCL.1(=value) ; port RGB_SCL
NetR18_1: R18.1 SDA.1(=value) ; port RGB_SDA
NetR27_1: R27.1 ; port LED_1
NetR28_1: R28.1 ; port LED_2
NetR29_1: R29.1 S2.1 ; port BUTTON_1
NetR30_1: R30.1 ; port LED_3
NetR31_2: R31.2 S3.1 ; port BUTTON_2
NetR33_1: R33.1 ; port LED_4
NetU2_29: UT.1(=value) ; port ULTRA_TRIG
NetU2_30: UE.1(=value) ; port ULTRA_ECHO

### Library data of the parts
D3 = DIO_LED_Y: LED YELLOW DIFFUSED 0805 SMD; Part Number: LY R976-PS-36; Manufacturer: OSRAM; Forward Voltage Drop: 2.2V; Package: 0805 (2012 Metric)
D4-D6 = DIO_LED_G: LED GREEN DIFFUSED 0805 SMD; Part Number: LG R971-KN-1; Manufacturer: OSRAM; Forward Voltage Drop: 2.2V; Package: 0805 (2012 Metric)
MH1-MH4 = MOUNTING_HOLES: 6cm x 6cm
R17 R18 = RES_4K7_0603: as R3 on sheet connectors; Package: 0603 (1608 Metric); Dimensions: 0.063" L x 0.031" W (1.60mm x 0.80mm); Tolerance: 5%
R19-R26 R29 R31 = RES_10K_0603: as R4 on sheet connectors; Package: 0603 (1608 Metric); Dimensions: 0.063" L x 0.031" W (1.60mm x 0.80mm); Tolerance: 5%
R27 R28 R30 R33 = RES_150K_0603: RES SMD 150K OHM 5% 1/10W 0603; Manufacturer: Yageo; Part Number (MPN): RC0603JR-07150KL; Package: 0603 (1608 Metric); Dimensions: 0.063" L x 0.031" W (1.60mm x 0.80mm); Tolerance: 5%
R32 = RES_0R_0603: as R1 on sheet can; Package: 0603 (1608 Metric); Dimensions: 0.063" L x 0.031" W (1.60mm x 0.80mm)
S2 S3 = SW_TACTILE: Tactile Switch (Grey); Manufacturer Part Number: B3U-1100P; Digikey Part Number: SW1021TR-ND
-5V = TESTPOINT_SMD: Part Number (MPN): *

## Nets that join several sheets
+3V3: can (C1.2 U1.3), connectors (P1.1 R3.2 TEMP.3), mcu (14 pins), power (3V3.1 C27.2 R16.2 VR1.2), support (7 pins)
+5V: connectors (10 pins), ph (9 pins), power (C26.2 VR1.3)
-5V: ph (9 pins), support (-5V.1)
GND: can (C1.1 D1.3 R1.2 U1.2), connectors (17 pins), mcu (18 pins), ph (15 pins), power (5 pins), support (13 pins)
CAN_H: can (CANH1.1 D1.1 R2.1 U1.7), connectors (CAN1.1 CAN2.1)
CAN_L: can (1.1 CANL1.1 D1.2 U1.6), connectors (CAN1.2 CAN2.2)
NetE-C_1: connectors (E-C.1 R4.1), mcu (U2.23), support (EC1.1)
NetE-C_2: connectors (E-C.2 R6.1), mcu (U2.24), support (EC2.1)
NetE-C_3: connectors (E-C.3), mcu (U2.25), support (ECI.1)
NetE-E_1: connectors (E-E.1 R5.1), mcu (U2.26), support (EE1.1)
NetE-E_2: connectors (E-E.2 R7.1), mcu (U2.27), support (EE2.1)
NetE-E_3: connectors (E-E.3), mcu (U2.28), support (EEI.1)
NetLS-C_1: connectors (LS-C.1), mcu (U2.41), support (R24.1)
NetLS-E-B_1: connectors (LS-E-B.1), mcu (U2.45), support (R26.1)
NetLS-ET_1: connectors (LS-ET.1), mcu (U2.44), support (R25.1)
NetM-A_1: connectors (M-A.1), mcu (U2.36), support (PWMA.1 R23.2)
NetM-A_2: connectors (M-A.2), mcu (U2.37)
NetM-C_1: connectors (M-C.1), mcu (U2.38), support (PWMC.1 R21.2)
NetM-C_2: connectors (M-C.2), mcu (U2.39)
NetM-E_1: connectors (M-E.1), mcu (U2.34), support (PWME.1 R19.2)
NetM-E_2: connectors (M-E.2), mcu (U2.35)
NetM-F_3: connectors (M-F.3), mcu (U2.42), support (PWMF.1 R22.2)
NetM-P_3: connectors (M-P.3), mcu (U2.40), support (PWMP.1 R20.2)
NetMOIST_1: connectors (MOIST.1), mcu (U2.20), support (MOIST-P.1)
NetMOIST_2: connectors (MOIST.2), mcu (U2.21), support (MOIST-D.1)
NetP1_2: connectors (P1.2), mcu (U2.51), support (UART_U.1)
NetP1_3: connectors (P1.3), mcu (U2.52), support (UART_R.1)
NetP1_4: connectors (P1.4), mcu (U2.54), support (UART_RTS.1)
NetP1_6: connectors (P1.6), mcu (U2.46)
NetP1_7: connectors (P1.7), mcu (U2.49)
NetPH_1: mcu (U2.22), ph (R10.2 U4.6), support (PH.1)
NetR3_1: connectors (R3.1 TEMP.2), mcu (U2.50), support (TEMPT.1)
NetR17_1: connectors (RGB.1), mcu (U2.58), support (R17.1 SCL.1)
NetR18_1: connectors (RGB.2), mcu (U2.59), support (R18.1 SDA.1)
NetR27_1: mcu (U2.8), support (R27.1)
NetR28_1: mcu (U2.9), support (R28.1)
NetR29_1: mcu (U2.14), support (R29.1 S2.1)
NetR30_1: mcu (U2.10), support (R30.1)
NetR31_2: mcu (U2.15), support (R31.2 S3.1)
NetR33_1: mcu (U2.11), support (R33.1)
NetU1_1: can (U1.1), mcu (U2.62)
NetU1_4: can (U1.4), mcu (U2.61)
NetU2_29: connectors (ULTRA.2), mcu (U2.29), support (UT.1)
NetU2_30: connectors (ULTRA.3), mcu (U2.30), support (UE.1)
~{RST}: connectors (P1.8), mcu (C4.2 S1.2 U2.7)